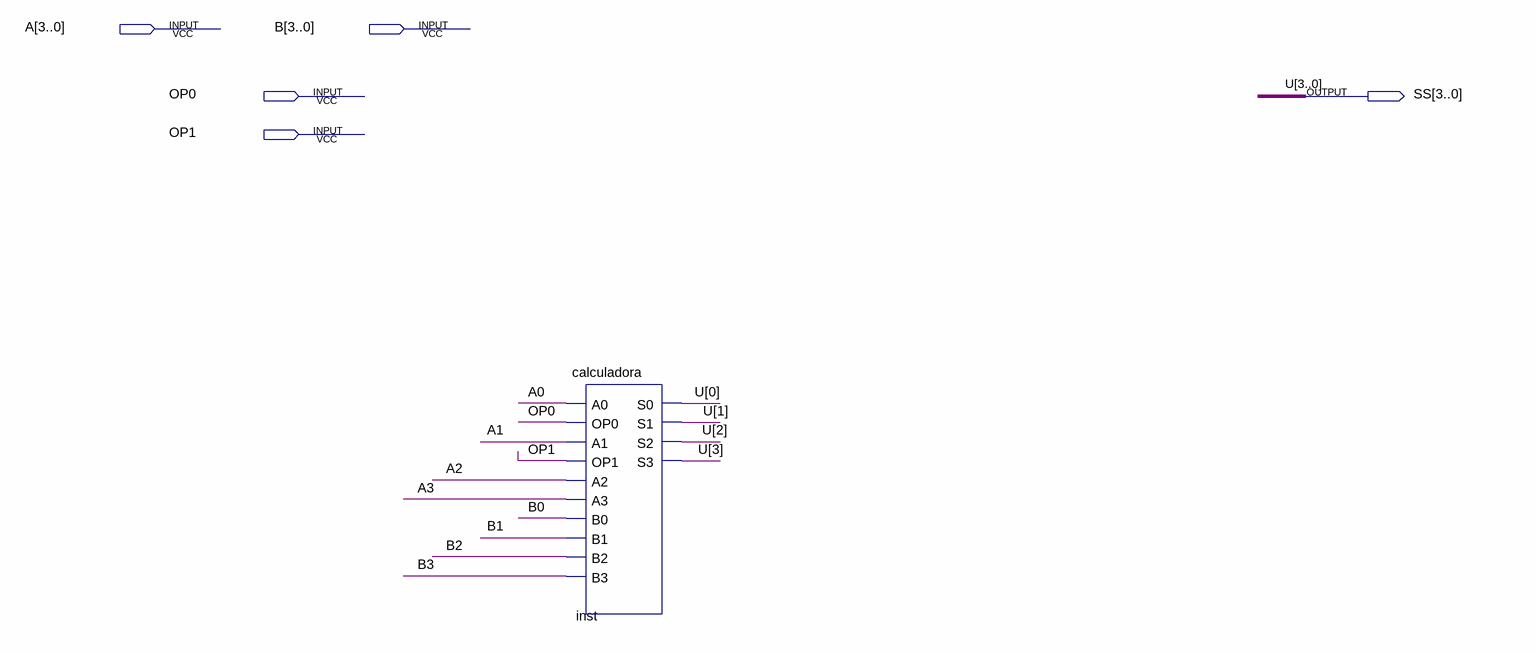
[diagram p0: schematic sheet]
// Quartus schematic ULA.bdf as structural Verilog: 1 symbols, 5 pins
module ULA (
  input  [3:0] A,
  input  [3:0] B,
  input  OP0,
  input  OP1,
  output [3:0] SS
);

  calculadora inst (
    .A0(A[0]), .OP0(OP0), .A1(A[1]), .OP1(OP1), .A2(A[2]), .A3(A[3]), .B0(B[0]), .B1(B[1]), .B2(B[2]),
    .B3(B[3]), .S0(SS[0]), .S1(SS[1]), .S2(SS[2]), .S3(SS[3]));

  // Other names for the same wires on the sheet: U[3:0] = SS
endmodule
